# EasyEDA schematic schematic_advanced_easyeda_export.json
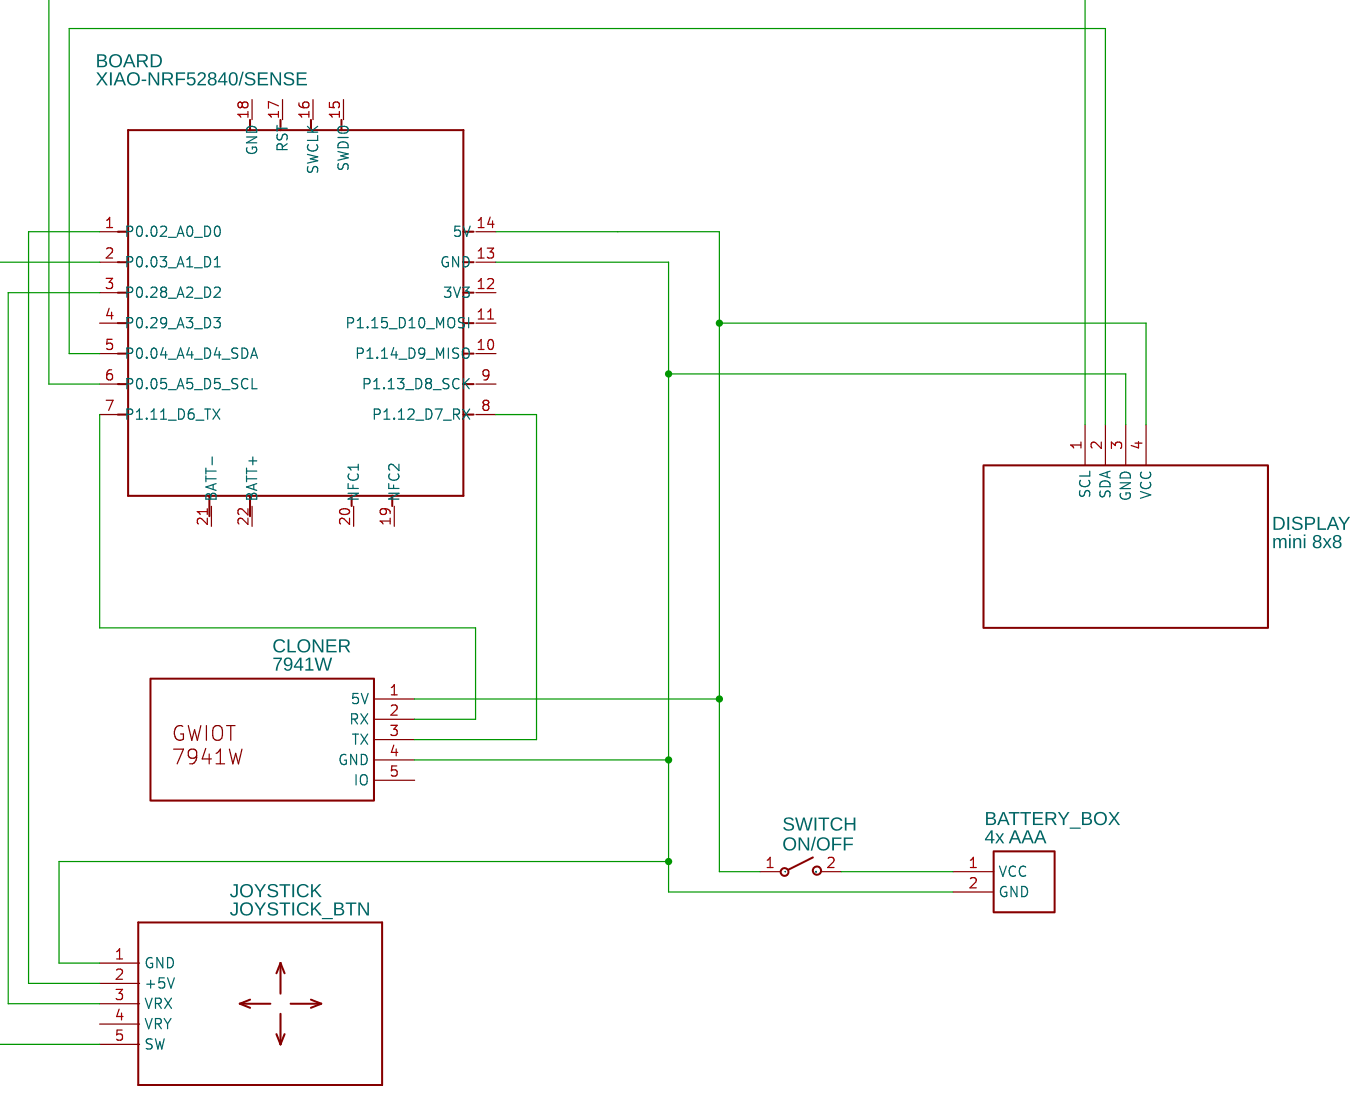
[diagram p0: schematic sheet]

## Parts
BATTERY_BOX  4x AAA  [BAT-TH_BC2AA]
BOARD  XIAO-NRF52840/SENSE  [XIAO-NRF52840/SENSE-MODULE14P-2.54-21X17.8MM]
CLONER  7941W  [2647]
DISPLAY  mini 8x8  [MINI 8X8]
JOYSTICK  JOYSTICK_BTN  [JOYSTICK-2AXIS-BUTTON-MODULE]
SWITCH  ON/OFF

## Library data of the parts
BATTERY_BOX = No.52Section side by side battery box: Supplier: LCSC; Manufacturer: 国产; Manufacturer Part: 五号2节并列电池盒; Supplier Part: C5404; JLCPCB Part Class: Extended Part
BOARD = XIAO-NRF52840/SENSE: Contributor: pierrecainnov
CLONER = 7941W: Manufacturer: GWIOT; Supplier: GWIOT; Contributor: en
DISPLAY = mini 8x8: sourceId: 1T5FDZYC8
JOYSTICK = JOYSTICK_BTN: Contributor: arenda1234
SWITCH = SW_SPST: Contributor: KiCAD; license: https://www.gnu.org/licenses/lgpl-2.1.html

## Nets
Net-(BATTERY_BOX-1): BATTERY_BOX.1(VCC) SWITCH.2(B)
Net-(BATTERY_BOX-2): BATTERY_BOX.2(GND) BOARD.13(GND) CLONER.4(GND) DISPLAY.3(GND) JOYSTICK.1(GND)
Net-(BOARD-1): BOARD.1(P0.02_A0_D0) JOYSTICK.2(+5V)
Net-(BOARD-2): BOARD.2(P0.03_A1_D1) JOYSTICK.5(SW)
Net-(BOARD-3): BOARD.3(P0.28_A2_D2) JOYSTICK.3(VRX)
Net-(BOARD-5): BOARD.5(P0.04_A4_D4_SDA) DISPLAY.2(SDA)
Net-(BOARD-6): BOARD.6(P0.05_A5_D5_SCL) DISPLAY.1(SCL)
Net-(BOARD-7): BOARD.7(P1.11_D6_TX) CLONER.2(RX)
Net-(BOARD-8): BOARD.8(P1.12_D7_RX) CLONER.3(TX)
Net-(BOARD-14): BOARD.14(5V) CLONER.1(5V) DISPLAY.4(VCC) SWITCH.1(A)

Not connected (* = marked no-connect by the designer): BOARD 4(P0.29_A3_D3) 9(P1.13_D8_SCK) 10(P1.14_D9_MISO) 11(P1.15_D10_MOSI) 12(3V3) 15(SWDIO) 16(SWCLK) 17(RST) 18(GND) 19(NFC2) 20(NFC1) 21(BATT-) 22(BATT+); CLONER 5(IO); JOYSTICK 4(VRY)
